# Altium schematic sheet 10uF SMD Ceramic 603.schdoc
size 41 x 30 mm
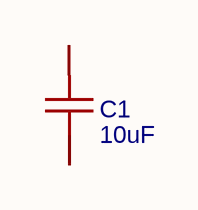
[diagram p0: 10uF SMD Ceramic 603.schdoc]

## Parts
C1  10uF  [C0603]

## Nets

Not connected (* = marked no-connect by the designer): C1 1 2

## Library data of the parts
C1 = 10uF: Manufacturer: muRata(村田); Manufacturer Part: GRM188B31A106KE69D; nameAlias: Value; Contributor: LCSC; Supplier: LCSC; Supplier Part: C469532; JLCPCB Part Class: Extended Part; spicePre: C; spiceSymbolName: GRM188B31A106KE69D